# Altium schematic sheet MT32Pi_lite.SchDoc: MT32-pi
size A4; DocumentNumber: 1; Revision: 2.1; SheetNumber: 1; SheetTotal: 1
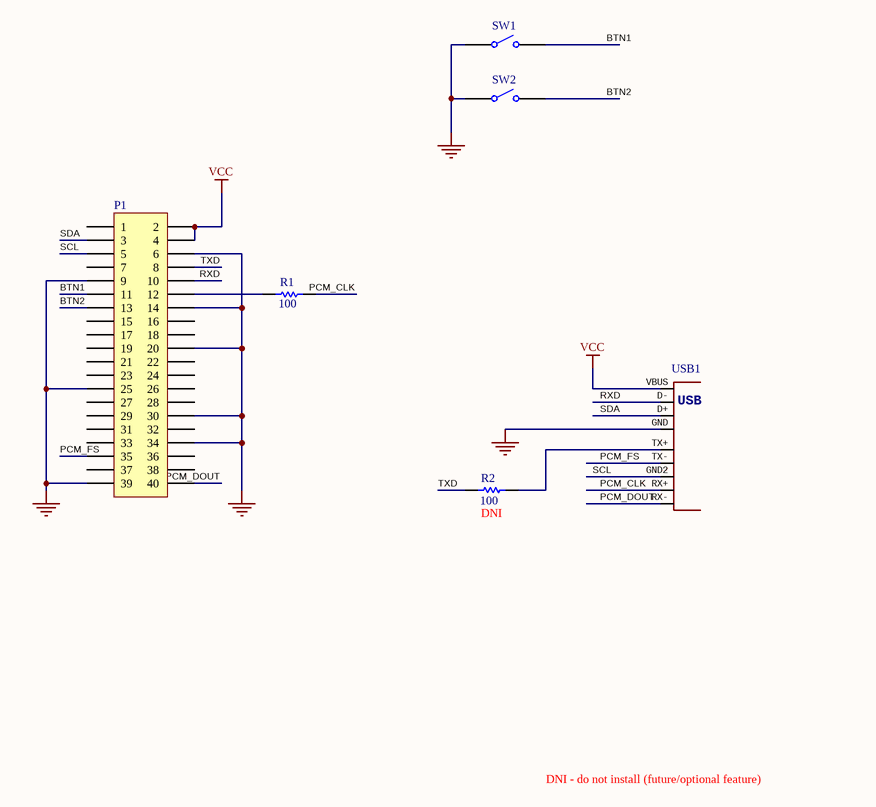
[diagram p0: MT32Pi_lite.SchDoc]

## Parts
P1  Header 20X2  [HDR20x2]  (value not drawn)
R1  100  [R0805]
R2  100  [R0805 - DNI]
SW1  Tact_60X35  [TACT_60X35]  (value not drawn)
SW2  Tact_60X35  [TACT_60X35]  (value not drawn)
USB1  USBA30-PTH  [USB3-A-M-PTH]  (value not drawn)

## Nets
GND: P1.6 P1.9 P1.14 P1.20 P1.25 P1.30 P1.34 P1.39 SW1.1 SW2.1 USB1.GND
VCC: P1.2 P1.4 USB1.VBUS
BTN1: P1.11 SW1.2
BTN2: P1.13 SW2.2
PCM_CLK: R1.1 USB1.RX+
PCM_DOUT: P1.40 USB1.RX-
PCM_FS: P1.35 USB1.TX-
RXD: P1.10 USB1.D-
SCL: P1.5 USB1.GND2
SDA: P1.3 USB1.D+
TXD: P1.8 R2.1
NetP1_12: P1.12 R1.2
NetR2_2: R2.2 USB1.TX+

Not connected (* = marked no-connect by the designer): P1 1 7 15 16 17 18 19 21 22 23 24 26 27 28 29 31 32 33 36 37 38

## Notes on the sheet
- (near R2) DNI
- DNI - do not install (future/optional feature)
- Title
- Size:
- Date:
- A4
- Number:
- Time:
- Revision:
- Sheet
- of
- File:

## Library data of the parts
P1 = Header 20X2: Header, 20-Pin, Dual row; LatestRevisionDate: 17-Jul-2002; LatestRevisionNote: Re-released for DXP Platform.; Publisher: Altium Limited
R1 R2 = ERJ6RS: Low Ohmic Value Thick Film Chip Resistor, 0.1 Ohm to 0.2 Ohm Range, 1%, 2% and 5% Tolerance, 0805 Size, 0.125 W; Published: 17-Dec-2003; LatestRevisionDate: 19-Mar-2004; LatestRevisionNote: Silkscreen size reduced.; PackageDocument: Mar-2003; PackageReference: 6-0805; Publisher: Altium Limited; Code_IPC: 2012 [0805]; ComponentLink1Description: Manufacturer Link; ComponentLink1URL: http://www.panasonic.com/industrial/components/resistive_products.htm; ComponentLink2Description: Datasheet; ComponentLink2URL: http://www.panasonic.com/industrial/components/pdf/AOA0000CE3.pdf
SW1 SW2 = Tact_60X35: Tact 6.0mm X 3.5mm; PartNumber: 434111050826; NoPins: 02; PackageReference: 434111050826; ComponentLink1Description: Manufacturer URL; ComponentLink1URL: http://www.we-online.com; ComponentLink2Description: Datasheet; ComponentLink2URL: http://katalog.we-online.de/em/datasheet/434111050826.pdf
USB1 = USBA30-PTH: USB: USB